# EAGLE design pwrsupply1 (EAGLE 6.6.0)
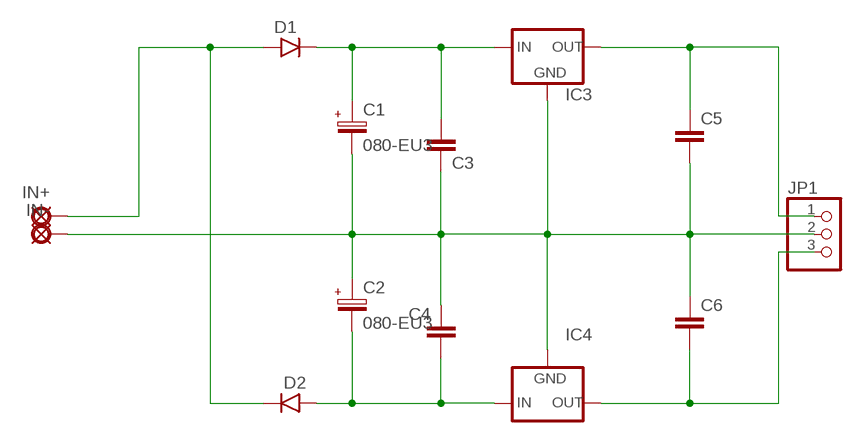
[diagram p0: schematic, sheet 1]

## Parts
C1  080-EU3  [080_035_3]
C2  080-EU3  [080_035_3]
C3  070X0303  [070X030_3]
C4  070X0303  [070X030_3]
C5  070X0305  [070X030_5]
C6  070X0302  [070X030]
D1  1N400X.4  [DO41-4]
D2  1N400X.4  [DO41-4]
IC3  78XXL  [78XXL]
IC4  79XXL  [79XXL]
IN+  PAD8  [OCTOGON]
IN-  PAD8  [OCTOGON]
JP1  PINHD-1X3  [1X03]

## Nets
+15: C5.1 IC3.OUT JP1.1
-15: C6.2 IC4.OUT JP1.3
GND: C1.- C2.+ C3.1 C4.1 C5.2 C6.1 IC3.GND IC4.GND IN-.1(PAD) JP1.2
N$1: D1.A D2.C IN+.1(PAD)
N$3: C1.+ C3.2 D1.C IC3.IN
N$4: C2.- C4.2 D2.A IC4.IN

## Library data of the parts
C1 C2 = gm-caps-electro-pol:080-EU
C3-C6 = gm-caps-film-chicklet:070X030: 0.0001 - .01uF (100 - 10,000pF) Panasonic ECQ-B 7mm x 3mm 50 or 63V: 0.0001 - .01uF (100 - 10,000pF);
D1 D2 = gm-diodes:1N400X: Rectifier Diodes often used in power supply to prevent damage from reverse polarization
IC3 = v-reg:78XXL: VOLTAGE REGULATOR
IC4 = v-reg:79XXL: VOLTAGE REGULATOR
IN+ IN- = gm-supply:PAD: PAD use this package for pads with any purpose, including input, output, send or return various pad shapes: round, square, octogonal, long, and long offset
JP1 = pinhead:PINHD-1X3: PIN HEADER

## Board
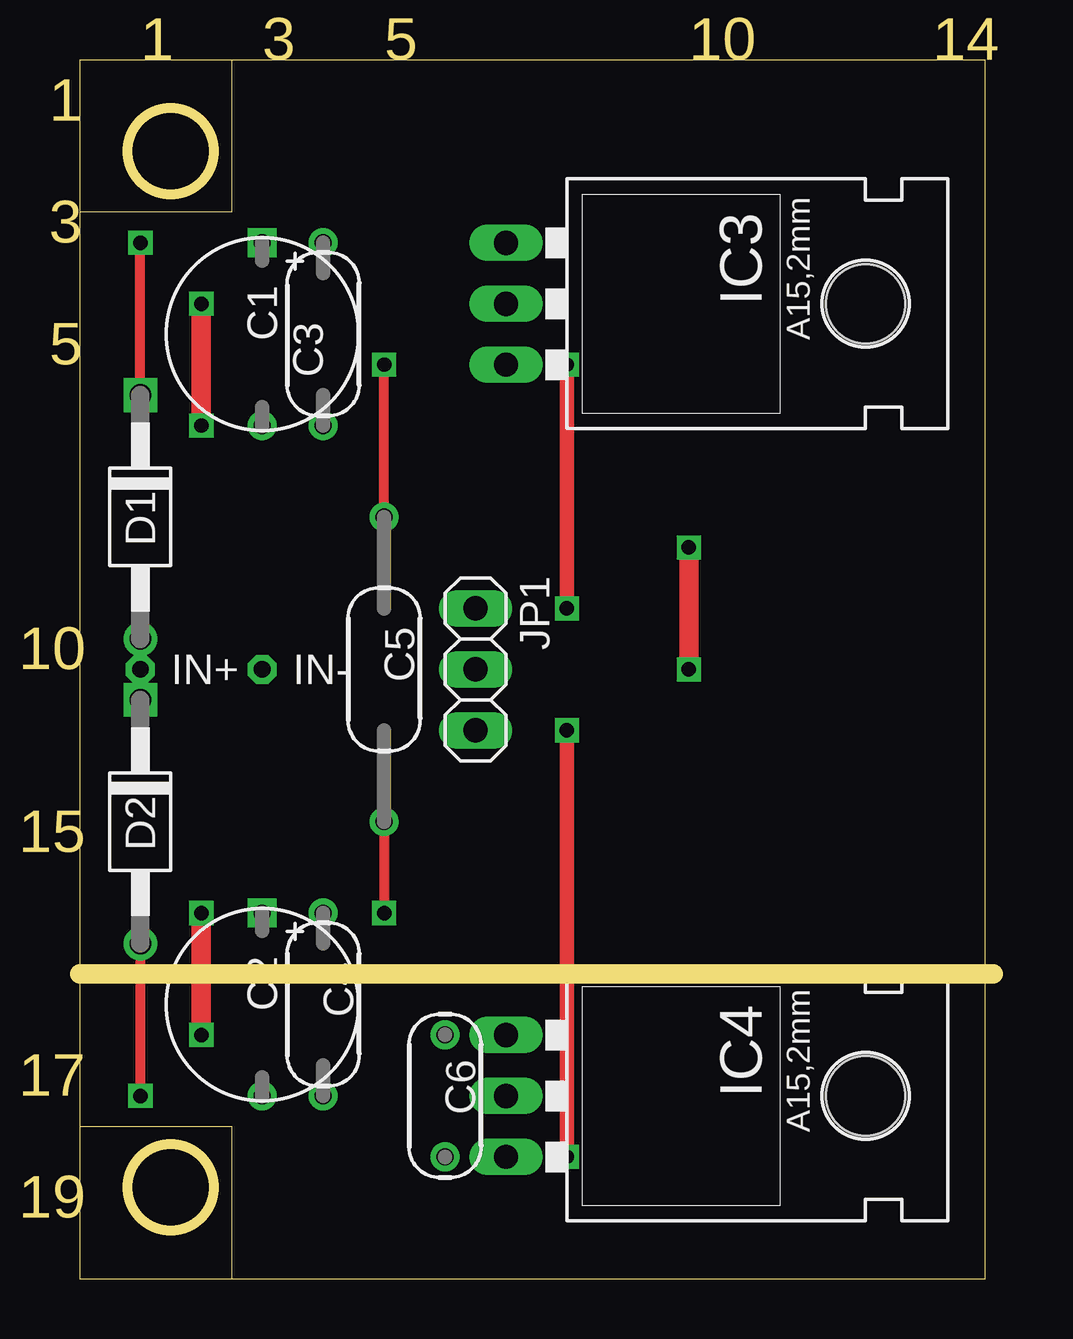
[diagram p1: board, top side]
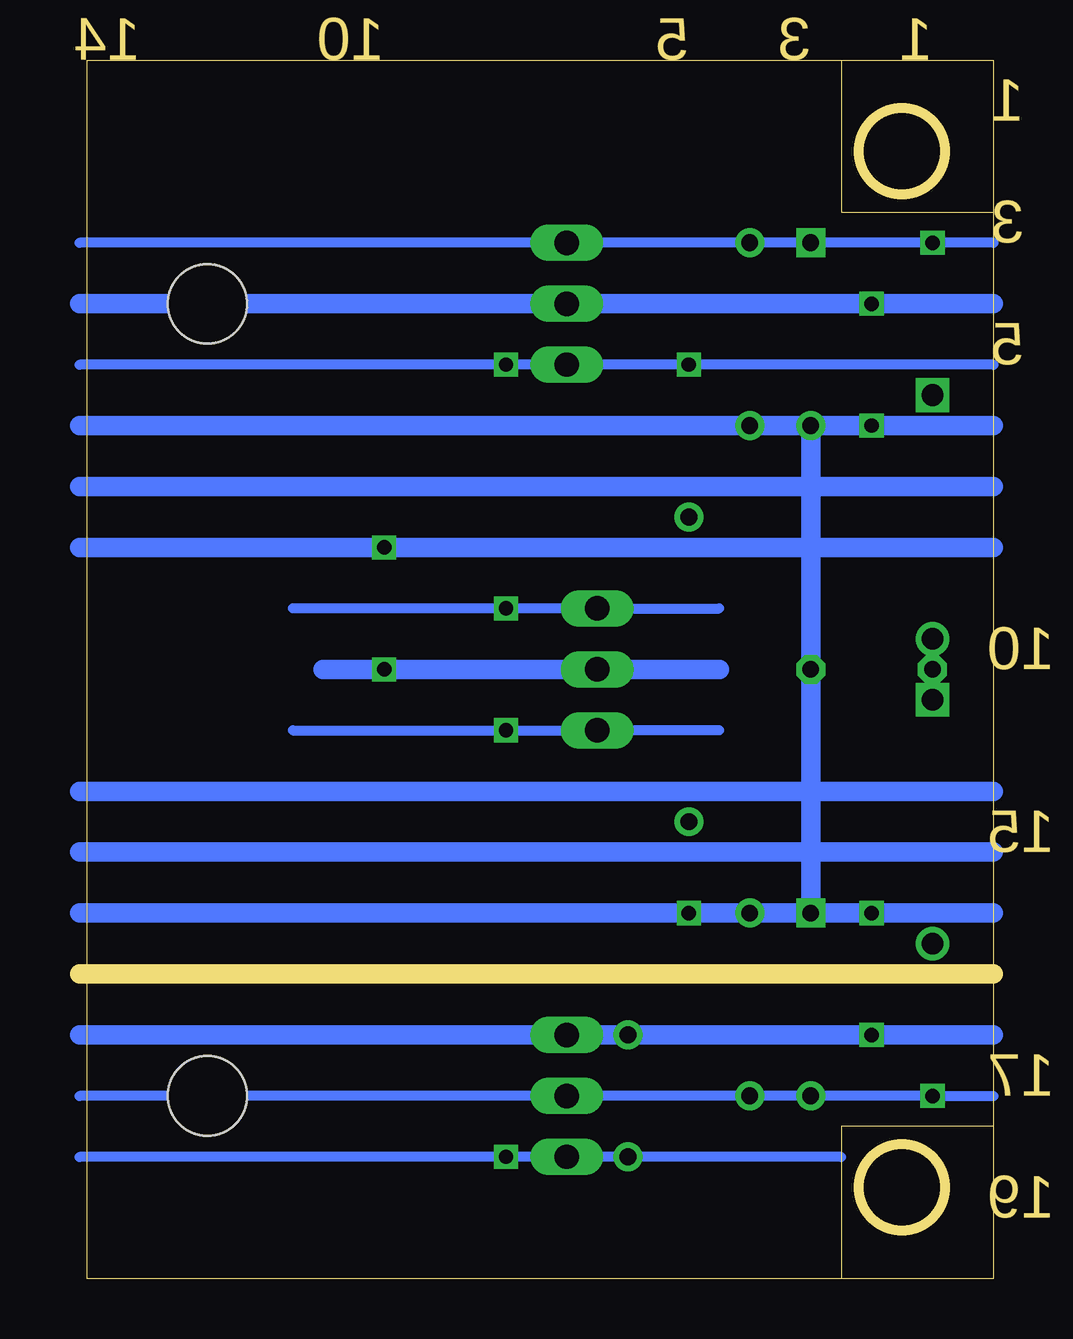
[diagram p2: board, bottom side, seen from below]

Size 38.1 x 50.8 mm. Coordinates in mm from the lower left corner, seen from the top.
Outline: 6.35,0 0,0 0,6.35
Outline: 6.35,0 37.77,0 37.77,50.79 0,50.79 0,44.45
Outline: 0,44.45 0,33.02 0,17.78 0,12.7
Outline: 0,12.7 0,6.35
Outline: 0,6.35 6.35,6.35 6.35,0
Outline: 6.35,50.8 6.35,44.45 0,44.45
Outline: 0,12.7 38.1,12.7
Outline: circle at 3.81,3.81 radius 1.8
Outline: circle at 3.81,46.99 radius 1.8
Copper layers (1*16): Top 0.035mm / dielectric 1.5mm / Bottom 0.035mm
Design rules "default": minimum track width 10mil, minimum drill 24mil, track to track 8mil, track to pad 8mil, pad to pad 8mil, via to via 8mil, smd to smd 8mil, copper to edge 40mil, drill to drill 8mil, minimum pad ring 10mil, minimum via ring 8mil, stop-mask expansion 4mil, vias tented up to drill 0mil, thermal gap 10mil

### Footprints (pad centres in the part's own frame; a part is rotated, then mirrored left to right if it is on the bottom)
080_035_3 = drill 0.7 square: + -3.81,0 | drill 0.7: - 3.81,0
070X030_3 = drill 0.7: 1 -3.81,0; 2 3.81,0
070X030_5 = drill 0.7: 1 -6.35,0; 2 6.35,0
070X030 = drill 0.7: 1 -2.54,0; 2 2.54,0
DO41-4 = drill 0.9: A 5.08,0 | drill 0.9 square: C -5.08,0
78XXL = drill 1.016 long: GND 0,-3.81; IN -2.54,-3.81; OUT 2.54,-3.81 | hole 3.302: 0,11.176
79XXL = drill 1.016 long: GND -2.54,-3.81; IN 0,-3.81; OUT 2.54,-3.81 | hole 3.302: 0,11.176
OCTOGON = drill 0.7 octagon: 1 0,0
1X03 = drill 1.016 long: 1 -2.54,0; 2 0,0; 3 2.54,0

### Placement (x,y rotation side)
C1  7.62,39.37 270 top
C2  7.62,11.43 270 top
C3  10.16,39.37 90 top
C4  10.16,11.43 270 top
C5  12.7,25.4 270 top
C6  15.24,7.62 270 top
D1  2.54,31.75 270 top
D2  2.54,19.05 270 top
IC3  21.59,40.64 270 top
IC4  21.59,7.62 270 top
IN+  2.54,25.4 0 top
IN-  7.62,25.4 0 top
JP1  16.51,25.4 270 top

### Tracks (layer width: path | path; a pad name or v marks a point on that pad's centre or on a via)
+15  (via drill 0.6)
  Top 0.406: C5.1 v12.7,38.1
  Top 0.61: v20.32,38.1 v20.32,27.94
  Bottom 0.406: 38.1,38.1 v20.32,38.1 IC3.OUT v12.7,38.1 0,38.1 | 29.21,27.94 v20.32,27.94 JP1.1 11.43,27.94
-15  (via drill 0.6)
  Top 0.61: v20.32,22.86 v20.32,5.08
  Bottom 0.406: 6.35,5.08 C6.2 IC4.OUT v20.32,5.08 38.1,5.08 | 29.21,22.86 v20.32,22.86 JP1.3 11.43,22.86
GND  (via drill 0.6)
  Top 0.406: C5.2 v12.7,15.24
  Top 0.813: v25.4,25.4 v25.4,30.48 | v5.08,15.24 v5.08,10.16 | v5.08,35.56 v5.08,40.64
  Bottom 0.813: 0,20.32 7.62,20.32 | 7.62,20.32 38.1,20.32 | 0,30.48 7.62,30.48 | 7.62,30.48 v25.4,30.48 38.1,30.48 | 0,15.24 v5.08,15.24 C2.+ | C2.+ C4.1 v12.7,15.24 38.1,15.24 | 0,35.56 v5.08,35.56 C1.- | C1.- C3.1 38.1,35.56 | 0,40.64 v5.08,40.64 IC3.GND 38.1,40.64 | 0,10.16 v5.08,10.16 C6.1 IC4.GND 38.1,10.16 | 27.94,25.4 v25.4,25.4 JP1.2 11.43,25.4 | C1.- 7.62,33.02 | 7.62,33.02 7.62,30.48 | 7.62,30.48 IN-.1 7.62,20.32 | 0,33.02 7.62,33.02 | 7.62,33.02 38.1,33.02 | 7.62,20.32 C2.+
N$1
  Bottom 0.406: D1.A IN+.1 D2.C
N$2
  Bottom 0.813: 0,17.78 38.1,17.78
N$3  (via drill 0.6)
  Top 0.406: D1.C v2.54,43.18
  Bottom 0.406: 0,43.18 v2.54,43.18 C1.+ C3.2 IC3.IN 38.1,43.18
N$4  (via drill 0.6)
  Top 0.406: D2.A v2.54,7.62
  Bottom 0.406: 38.1,7.62 IC4.IN C4.2 C2.- v2.54,7.62 0,7.62

### Text on the board
Dimension: 1 | 3 | 5 | 10 | 14 | 1 | 3 | 5 | 10 | 15 | 17 | 19